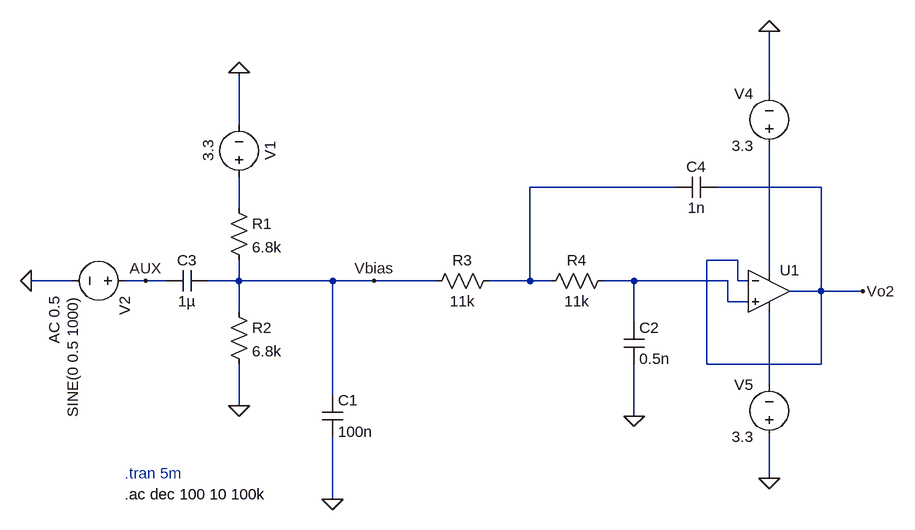
[diagram p0: schematic Entrada.asc]
Entrada.asc, the LTspice schematic file:
Version 4.1
SHEET 1 1628 680
WIRE 1344 -208 1344 -304
WIRE 528 -160 528 -240
WIRE 1200 -64 976 -64
WIRE 1424 -64 1264 -64
WIRE 528 -32 528 -80
WIRE 1296 48 1248 48
WIRE 1344 64 1344 -128
WIRE 272 80 208 80
WIRE 384 80 352 80
WIRE 416 80 384 80
WIRE 528 80 528 48
WIRE 528 80 480 80
WIRE 672 80 528 80
WIRE 736 80 672 80
WIRE 832 80 736 80
WIRE 976 80 976 -64
WIRE 976 80 912 80
WIRE 1008 80 976 80
WIRE 1136 80 1088 80
WIRE 1280 80 1136 80
WIRE 1296 80 1296 48
WIRE 1312 80 1296 80
WIRE 1424 96 1424 -64
WIRE 1424 96 1376 96
WIRE 1488 96 1424 96
WIRE 1280 112 1280 80
WIRE 1312 112 1280 112
WIRE 528 128 528 80
WIRE 1136 144 1136 80
WIRE 1248 208 1248 48
WIRE 1424 208 1424 96
WIRE 1424 208 1248 208
WIRE 1344 240 1344 128
WIRE 672 256 672 80
WIRE 528 272 528 208
WIRE 1136 288 1136 208
WIRE 1344 384 1344 320
WIRE 672 416 672 320
FLAG 528 -240 0
FLAG 528 272 0
FLAG 208 80 0
FLAG 736 80 Vbias
FLAG 672 416 0
FLAG 384 80 AUX
FLAG 1136 288 0
FLAG 1488 96 Vo2
FLAG 1344 384 0
FLAG 1344 -304 0
SYMBOL res 512 -48 R0
SYMATTR InstName R1
SYMATTR Value 6.8k
SYMBOL res 512 112 R0
SYMATTR InstName R2
SYMATTR Value 6.8k
SYMBOL voltage 528 -64 R180
WINDOW 0 -32 56 VBottom 2
WINDOW 3 32 56 VTop 2
WINDOW 123 0 0 Left 0
WINDOW 39 0 0 Left 0
SYMATTR InstName V1
SYMATTR Value 3.3
SYMBOL cap 480 64 R90
WINDOW 0 0 32 VBottom 2
WINDOW 3 32 32 VTop 2
SYMATTR InstName C3
SYMATTR Value 1µ
SYMBOL voltage 368 80 R90
WINDOW 123 24 124 Left 2
WINDOW 39 0 0 Left 0
SYMATTR Value2 AC 0.5
SYMATTR InstName V2
SYMATTR Value SINE(0 0.5 1000)
SYMBOL cap 656 256 R0
SYMATTR InstName C1
SYMATTR Value 100n
SYMBOL cap 1120 144 R0
SYMATTR InstName C2
SYMATTR Value 0.5n
SYMBOL res 928 64 R90
WINDOW 0 0 56 VBottom 2
WINDOW 3 32 56 VTop 2
SYMATTR InstName R3
SYMATTR Value 11k
SYMBOL res 1104 64 R90
WINDOW 0 0 56 VBottom 2
WINDOW 3 32 56 VTop 2
SYMATTR InstName R4
SYMATTR Value 11k
SYMBOL cap 1264 -80 R90
WINDOW 0 0 32 VBottom 2
WINDOW 3 32 32 VTop 2
SYMATTR InstName C4
SYMATTR Value 1n
SYMBOL OpAmps\\UniversalOpAmp2 1344 96 R0
SYMATTR InstName U1
SYMBOL voltage 1344 -112 R180
WINDOW 0 24 96 Left 2
WINDOW 3 24 16 Left 2
WINDOW 123 0 0 Left 0
WINDOW 39 0 0 Left 0
SYMATTR InstName V4
SYMATTR Value 3.3
SYMBOL voltage 1344 336 R180
WINDOW 0 24 96 Left 2
WINDOW 3 24 16 Left 2
WINDOW 123 0 0 Left 0
WINDOW 39 0 0 Left 0
SYMATTR InstName V5
SYMATTR Value 3.3
TEXT 352 376 Left 2 ;.tran 5m
TEXT 352 408 Left 2 !.ac dec 100 10 100k

The netlist it stands for:
* Entrada.asc
R1 N002 Vbias 6.8k
R2 Vbias 0 6.8k
V1 N002 0 3.3
C3 Vbias AUX 1µ
V2 AUX 0 SINE(0 0.5 1000) AC 0.5
C1 Vbias 0 100n
C2 N004 0 0.5n
R3 N001 Vbias 11k
R4 N004 N001 11k
C4 Vo2 N001 1n
X§U1 N004 Vo2 N003 N005 Vo2 level2 Avol=1Meg GBW=10Meg Slew=10Meg Ilimit=25m Rail=0 Vos=0 En=0 Enk=0 In=0 Ink=0 Rin=500Meg  ; pins In+ In- V+ V- OUT
V4 N003 0 3.3
V5 0 N005 3.3
* .tran 5m
.ac dec 100 10 100k
.lib UniversalOpAmp2.lib
.backanno
.end